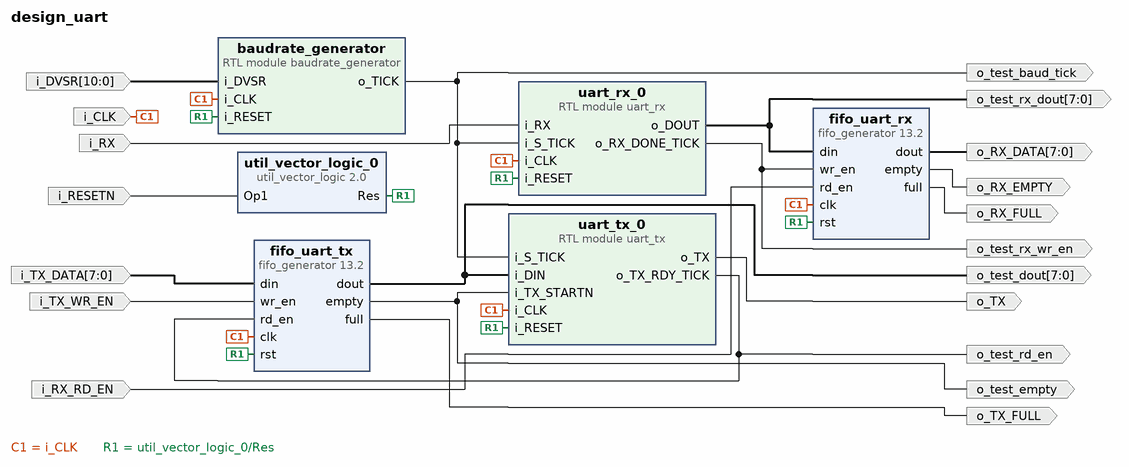
[diagram p0: block diagram of the top level]
# Vivado block design design_uart, xc7z020clg400-1, Vivado 2023.2
create_bd_design design_uart

create_bd_port -dir I -type clk i_CLK
create_bd_port -dir I -type rst i_RESETN
create_bd_port -dir I -from 10 -to 0 i_DVSR
create_bd_port -dir O o_test_rd_en
create_bd_port -dir O o_TX
create_bd_port -dir O o_test_baud_tick
create_bd_port -dir O o_TX_FULL
create_bd_port -dir I i_TX_WR_EN
create_bd_port -dir O o_test_empty
create_bd_port -dir O -from 7 -to 0 o_test_dout
create_bd_port -dir I -from 7 -to 0 i_TX_DATA
create_bd_port -dir I i_RX
create_bd_port -dir O o_RX_FULL
create_bd_port -dir O o_RX_EMPTY
create_bd_port -dir O -from 7 -to 0 o_RX_DATA
create_bd_port -dir I i_RX_RD_EN
create_bd_port -dir O o_test_rx_wr_en
create_bd_port -dir O -from 7 -to 0 o_test_rx_dout

create_bd_cell -type module -reference baudrate_generator baudrate_generator
create_bd_cell -type module -reference uart_tx uart_tx_0
create_bd_cell -type ip -vlnv xilinx.com:ip:fifo_generator:13.2 fifo_uart_tx
set_property -dict [list \
  CONFIG.Fifo_Implementation Common_Clock_Builtin_FIFO \
  CONFIG.INTERFACE_TYPE Native \
  CONFIG.Input_Data_Width 8 \
  CONFIG.Input_Depth 512 \
  CONFIG.Performance_Options Standard_FIFO \
  CONFIG.Use_Embedded_Registers false \
  CONFIG.Write_Acknowledge_Flag false \
] [get_bd_cells fifo_uart_tx]
create_bd_cell -type ip -vlnv xilinx.com:ip:util_vector_logic:2.0 util_vector_logic_0
set_property -dict {CONFIG.C_OPERATION not CONFIG.C_SIZE 1} [get_bd_cells util_vector_logic_0]
create_bd_cell -type ip -vlnv xilinx.com:ip:fifo_generator:13.2 fifo_uart_rx
set_property -dict [list \
  CONFIG.Fifo_Implementation Common_Clock_Builtin_FIFO \
  CONFIG.INTERFACE_TYPE Native \
  CONFIG.Input_Data_Width 8 \
  CONFIG.Input_Depth 512 \
  CONFIG.Performance_Options Standard_FIFO \
  CONFIG.Use_Embedded_Registers false \
  CONFIG.Write_Acknowledge_Flag false \
] [get_bd_cells fifo_uart_rx]
create_bd_cell -type module -reference uart_rx uart_rx_0

# ---- connections ----

connect_bd_net -net baudrate_generator_0_o_TICK [get_bd_pins baudrate_generator/o_TICK] \
  [get_bd_ports o_test_baud_tick] [get_bd_pins uart_rx_0/i_S_TICK] [get_bd_pins uart_tx_0/i_S_TICK]
connect_bd_net -net din_0_1 [get_bd_ports i_TX_DATA] [get_bd_pins fifo_uart_tx/din]
connect_bd_net -net fifo_generator_0_dout [get_bd_pins fifo_uart_tx/dout] [get_bd_ports o_test_dout] [get_bd_pins uart_tx_0/i_DIN]
connect_bd_net -net fifo_generator_0_full [get_bd_pins fifo_uart_tx/full] [get_bd_ports o_TX_FULL]
connect_bd_net [get_bd_pins fifo_uart_rx/dout] [get_bd_ports o_RX_DATA]
connect_bd_net [get_bd_pins fifo_uart_rx/empty] [get_bd_ports o_RX_EMPTY]
connect_bd_net [get_bd_pins fifo_uart_rx/full] [get_bd_ports o_RX_FULL]
connect_bd_net [get_bd_pins fifo_uart_tx/empty] [get_bd_ports o_test_empty] [get_bd_pins uart_tx_0/i_TX_STARTN]
connect_bd_net -net i_CLK_0_1 [get_bd_ports i_CLK] \
  [get_bd_pins fifo_uart_tx/clk] [get_bd_pins baudrate_generator/i_CLK] [get_bd_pins fifo_uart_rx/clk] \
  [get_bd_pins uart_rx_0/i_CLK] [get_bd_pins uart_tx_0/i_CLK]
connect_bd_net -net i_DVSR_0_1 [get_bd_ports i_DVSR] [get_bd_pins baudrate_generator/i_DVSR]
connect_bd_net [get_bd_ports i_RESETN] [get_bd_pins util_vector_logic_0/Op1]
connect_bd_net -net i_RX_0_1 [get_bd_ports i_RX] [get_bd_pins uart_rx_0/i_RX]
connect_bd_net -net rd_en_0_1 [get_bd_ports i_RX_RD_EN] [get_bd_pins fifo_uart_rx/rd_en]
connect_bd_net [get_bd_pins uart_rx_0/o_DOUT] [get_bd_ports o_test_rx_dout] [get_bd_pins fifo_uart_rx/din]
connect_bd_net [get_bd_pins uart_rx_0/o_RX_DONE_TICK] [get_bd_pins fifo_uart_rx/wr_en] [get_bd_ports o_test_rx_wr_en]
connect_bd_net [get_bd_pins uart_tx_0/o_TX] [get_bd_ports o_TX]
connect_bd_net -net uart_tx_0_o_TX_DONE_TICK [get_bd_pins uart_tx_0/o_TX_RDY_TICK] [get_bd_ports o_test_rd_en] [get_bd_pins fifo_uart_tx/rd_en]
connect_bd_net [get_bd_pins util_vector_logic_0/Res] \
  [get_bd_pins fifo_uart_tx/rst] [get_bd_pins baudrate_generator/i_RESET] [get_bd_pins fifo_uart_rx/rst] \
  [get_bd_pins uart_rx_0/i_RESET] [get_bd_pins uart_tx_0/i_RESET]
connect_bd_net -net wr_en_0_1 [get_bd_ports i_TX_WR_EN] [get_bd_pins fifo_uart_tx/wr_en]

validate_bd_design
save_bd_design
